# Altium project STM32_Smart.PrjPcb
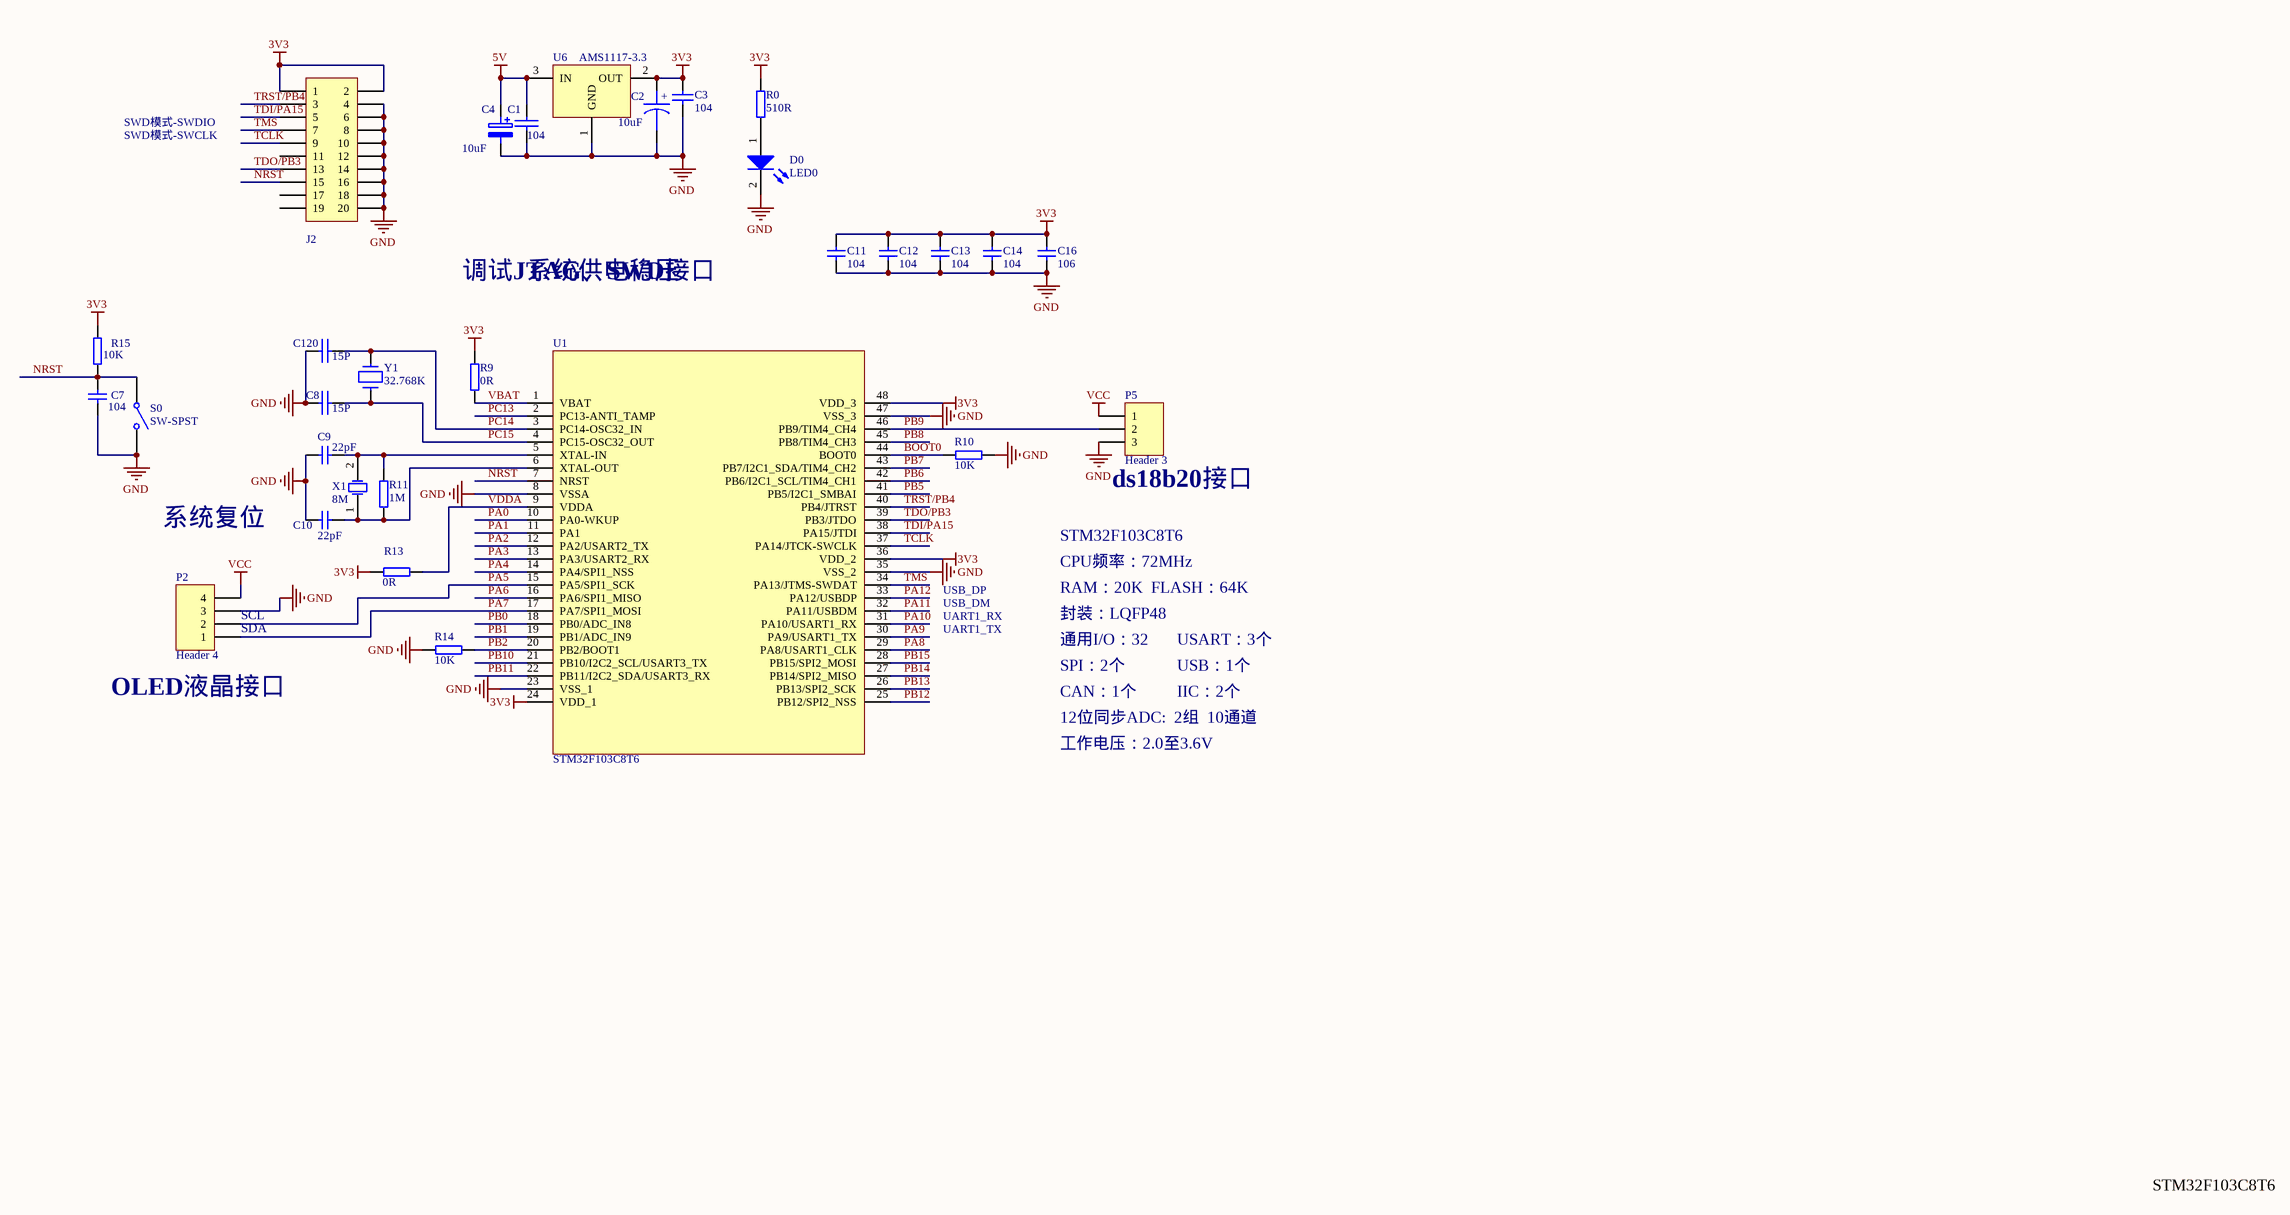
[diagram p0: STM32_Smart.SchDoc]
1 sheet, 30 parts. Net scope: global (net labels, ports and power ports of the same name join across sheets).
Board file: PCB1.PcbDoc

## Sheet STM32_Smart.SchDoc
size A3

### Parts
C1  104  [RC0603]
C2  10uF  [RC0805]
C3  104  [RC0603]
C4  10uF  [RC0805]
C7  104  [RC0603]
C8  15P  [RC0603]
C9  22pF  [RC0603]
C10  22pF  [RC0603]
C11  104  [RC0603]
C12  104  [RC0603]
C13  104  [RC0603]
C14  104  [RC0603]
C16  106  [RC0805]
C120  15P  [RC0603]
D0  LED0  [LED0805]
J2  (no value)  [JTAG20P]
P2  Header 4  [HDR1X4]
P5  Header 3  [HDR1X3]
R0  510R  [RC0603]
R9  0R  [RC0603]
R10  10K  [RC0603]
R11  1M  [RC0603]
R13  0R  [RC0603]
R14  10K  [RC0603]
R15  10K  [RC0603]
S0  SW-SPST  [SMT-KEY]
U1  STM32F103C8T6  [LQFP48]
U6  AMS1117-3.3  [SOT223]
X1  8M  [SMD49S]
Y1  32.768K  [JZ32768]

### Nets
3V3: C2.1 C3.1 C11.1 C12.1 C13.1 C14.1 C16.1 J2.1 J2.2 R0.2 R9.2 R13.2 R15.2 U1.24(VDD_1) U1.36(VDD_2) U1.48(VDD_3) U6.2(OUT)
5V: C1.1 C4.1 U6.3(IN)
GND: C1.2 C2.2 C3.2 C4.2 C7.2 C8.1 C9.2 C10.2 C11.2 C12.2 C13.2 C14.2 C16.2 C120.1 D0.2(K) J2.4 J2.6 J2.8 J2.10 J2.12 J2.14 J2.16 J2.18 J2.20 P2.3 P5.3 R10.1 R14.2 S0.2(NO) U1.8(VSSA) U1.23(VSS_1) U1.35(VSS_2) U1.47(VSS_3) U6.1(GND)
VCC: P2.4 P5.1
BOOT0: R10.2 U1.44(BOOT0)
NRST: C7.1 J2.15 R15.1 S0.1(COMMON) U1.7(NRST)
PA0: U1.10(PA0-WKUP)
PA1: U1.11(PA1)
PA2: U1.12(PA2/USART2_TX)
PA3: U1.13(PA3/USART2_RX)
PA4: U1.14(PA4/SPI1_NSS)
PA5: P2.2 U1.15(PA5/SPI1_SCK)
PA6: U1.16(PA6/SPI1_MISO)
PA7: P2.1 U1.17(PA7/SPI1_MOSI)
PA8: U1.29(PA8/USART1_CLK)
PA9: U1.30(PA9/USART1_TX)
PA10: U1.31(PA10/USART1_RX)
PA11: U1.32(PA11/USBDM)
PA12: U1.33(PA12/USBDP)
PB0: U1.18(PB0/ADC_IN8)
PB1: U1.19(PB1/ADC_IN9)
PB2: R14.1 U1.20(PB2/BOOT1)
PB5: U1.41(PB5/I2C1_SMBAI)
PB6: U1.42(PB6/I2C1_SCL/TIM4_CH1)
PB7: U1.43(PB7/I2C1_SDA/TIM4_CH2)
PB8: U1.45(PB8/TIM4_CH3)
PB9: P5.2 U1.46(PB9/TIM4_CH4)
PB10: U1.21(PB10/I2C2_SCL/USART3_TX)
PB11: U1.22(PB11/I2C2_SDA/USART3_RX)
PB12: U1.25(PB12/SPI2_NSS)
PB13: U1.26(PB13/SPI2_SCK)
PB14: U1.27(PB14/SPI2_MISO)
PB15: U1.28(PB15/SPI2_MOSI)
PC13: U1.2(PC13-ANTI_TAMP)
PC14: C120.2 U1.3(PC14-OSC32_IN) Y1.2
PC15: C8.2 U1.4(PC15-OSC32_OUT) Y1.1
TCLK: J2.9 U1.37(PA14/JTCK-SWCLK)
TDI/PA15: J2.5 U1.38(PA15/JTDI)
TDO/PB3: J2.13 U1.39(PB3/JTDO)
TMS: J2.7 U1.34(PA13/JTMS-SWDAT)
TRST/PB4: J2.3 U1.40(PB4/JTRST)
VBAT: R9.1 U1.1(VBAT)
VDDA: R13.1 U1.9(VDDA)
NetC9_1: C9.1 R11.2 U1.5(XTAL-IN) X1.2
NetC10_1: C10.1 R11.1 U1.6(XTAL-OUT) X1.1
NetD0_1: D0.1(A) R0.1

Not connected (* = marked no-connect by the designer): J2 11 17 19

### Notes on the sheet
- SWD模式-SWDIO
- SWD模式-SWCLK
- 调试JTAG、SWD接口
- 系统供电稳压
- (near P5) ds18b20接口
- 系统复位
- STM32F103C8T6
- CPU频率：72MHz
- (near P2) SDA
- (near P2) SCL
- UART1_TX
- UART1_RX
- USB_DM
- USB_DP
- RAM：20K
- 封装：LQFP48
- 通用I/O：32
- FLASH：64K
- USART：3个
- (near P2) OLED液晶接口
- CAN：1个
- SPI：2个
- USB：1个
- IIC：2个
- 12位同步ADC:  2组  10通道
- 工作电压：2.0至3.6V
- (in symbol CAPACITOR POL) +

### Library data of the parts
C1 = CAP: Capacitor
C2 = CAPACITOR POL: Capacitor
C3 = Cap: Capacitor; Published: 8-Jun-2000; LatestRevisionDate: 17-Jul-2002; LatestRevisionNote: Re-released for DXP Platform.; PackageReference: RAD-0.3; Publisher: Altium Limited
C4 = ELECTRO2
C7 C11-C14 C16 = CAP1: Capacitor; Tolerate: 50V; Value: 100nF; TOL: 10%; ERP: 0103020075; PCB_Layout: Top Layer SMC; Revision: 2012-3-28; Publisher: ZL_A0OFFICE
C8 C120 = CAP
C9 C10 = CAP1: Capacitor; Tolerate: 50V; Value: 20pF; TOL: 2%; ERP: 0103020090; PCB_Layout: Top Layer SMC; Revision: 2012-3-28; Publisher: ZL_A0OFFICE
D0 = LED0: Typical INFRARED GaAs LED
J2 = Header 10X2H: Header, 10-Pin, Dual row, Right Angle; LatestRevisionDate: 17-Jul-2002; LatestRevisionNote: Re-released for DXP Platform.; Publisher: Altium Limited
P2 = Header 4: Header, 4-Pin; LatestRevisionDate: 17-Jul-2002; LatestRevisionNote: Re-released for DXP Platform.; Publisher: Altium Limited
P5 = Header 3: Header, 3-Pin; LatestRevisionDate: 17-Jul-2002; LatestRevisionNote: Re-released for DXP Platform.; Publisher: Altium Limited
R0 R9-R11 R13-R15 = R
S0 = SW-SPST: Single-Pole, Single-Throw Switch
U6 = LT1085CM-3.3
X1 = XTAL_SMD: Crystal Oscillator; ERP: 0103040021; Value: 8MHz; TOL: ±20ppm; Tolerate: ROSON -20_+70 20pf; PCB_Layout: Top Layer SMC; Publisher: ZL_A0OFFICE; Revision: 2012-3-28
Y1 = CRYSTAL: 晶振